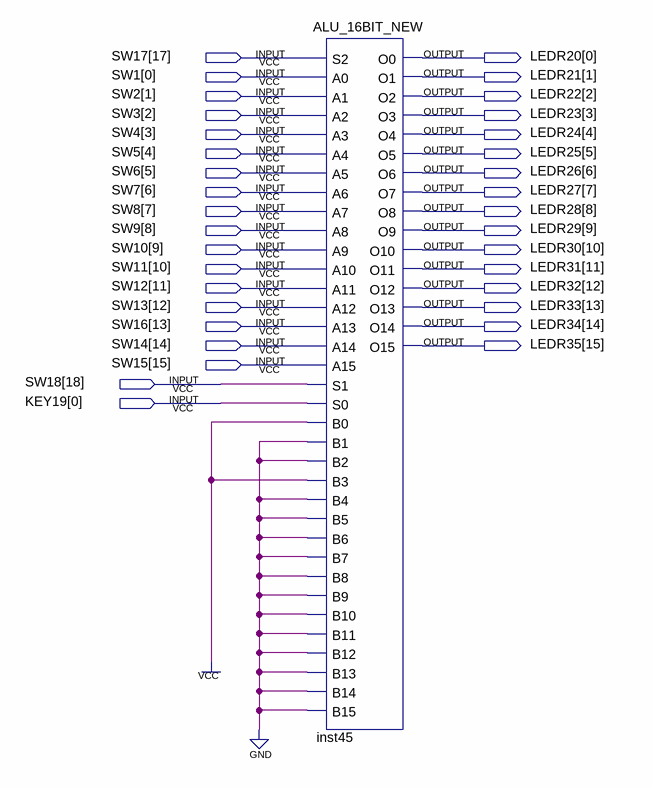
[diagram p0: schematic sheet]
// Quartus schematic ALU_KIT_DE2.bdf as structural Verilog: 1 symbols, 35 pins
module ALU_KIT_DE2 (
  input  [17:17] SW17,
  input  [0:0] SW1,
  input  [1:1] SW2,
  input  [2:2] SW3,
  input  [3:3] SW4,
  input  [4:4] SW5,
  input  [5:5] SW6,
  input  [6:6] SW7,
  input  [7:7] SW8,
  input  [8:8] SW9,
  input  [9:9] SW10,
  input  [10:10] SW11,
  input  [11:11] SW12,
  input  [12:12] SW13,
  input  [13:13] SW16,
  input  [14:14] SW14,
  input  [15:15] SW15,
  input  [18:18] SW18,
  input  [0:0] KEY19,
  output [0:0] LEDR20,
  output [1:1] LEDR21,
  output [2:2] LEDR22,
  output [3:3] LEDR23,
  output [4:4] LEDR24,
  output [5:5] LEDR25,
  output [6:6] LEDR26,
  output [7:7] LEDR27,
  output [8:8] LEDR28,
  output [9:9] LEDR29,
  output [10:10] LEDR30,
  output [11:11] LEDR31,
  output [12:12] LEDR32,
  output [13:13] LEDR33,
  output [14:14] LEDR34,
  output [15:15] LEDR35
);

  ALU_16BIT_NEW inst45 (
    .S2(SW17[17]), .A0(SW1[0]), .A1(SW2[1]), .A2(SW3[2]), .A3(SW4[3]), .A4(SW5[4]), .A5(SW6[5]), .A6(SW7[6]),
    .A7(SW8[7]), .A8(SW9[8]), .A9(SW10[9]), .A10(SW11[10]), .A11(SW12[11]), .A12(SW13[12]), .A13(SW16[13]),
    .A14(SW14[14]), .A15(SW15[15]), .S1(SW18[18]), .S0(KEY19[0]), .B0(1'b1), .B1(1'b0), .B2(1'b0), .B3(1'b1),
    .B4(1'b0), .B5(1'b0), .B6(1'b0), .B7(1'b0), .B8(1'b0), .B9(1'b0), .B10(1'b0), .B11(1'b0), .B12(1'b0),
    .B13(1'b0), .B14(1'b0), .B15(1'b0), .O0(LEDR20[0]), .O1(LEDR21[1]), .O2(LEDR22[2]), .O3(LEDR23[3]),
    .O4(LEDR24[4]), .O5(LEDR25[5]), .O6(LEDR26[6]), .O7(LEDR27[7]), .O8(LEDR28[8]), .O9(LEDR29[9]),
    .O10(LEDR30[10]), .O11(LEDR31[11]), .O12(LEDR32[12]), .O13(LEDR33[13]), .O14(LEDR34[14]), .O15(LEDR35[15]));
endmodule
